# EAGLE design tfsasi (EAGLE 9.6.2)
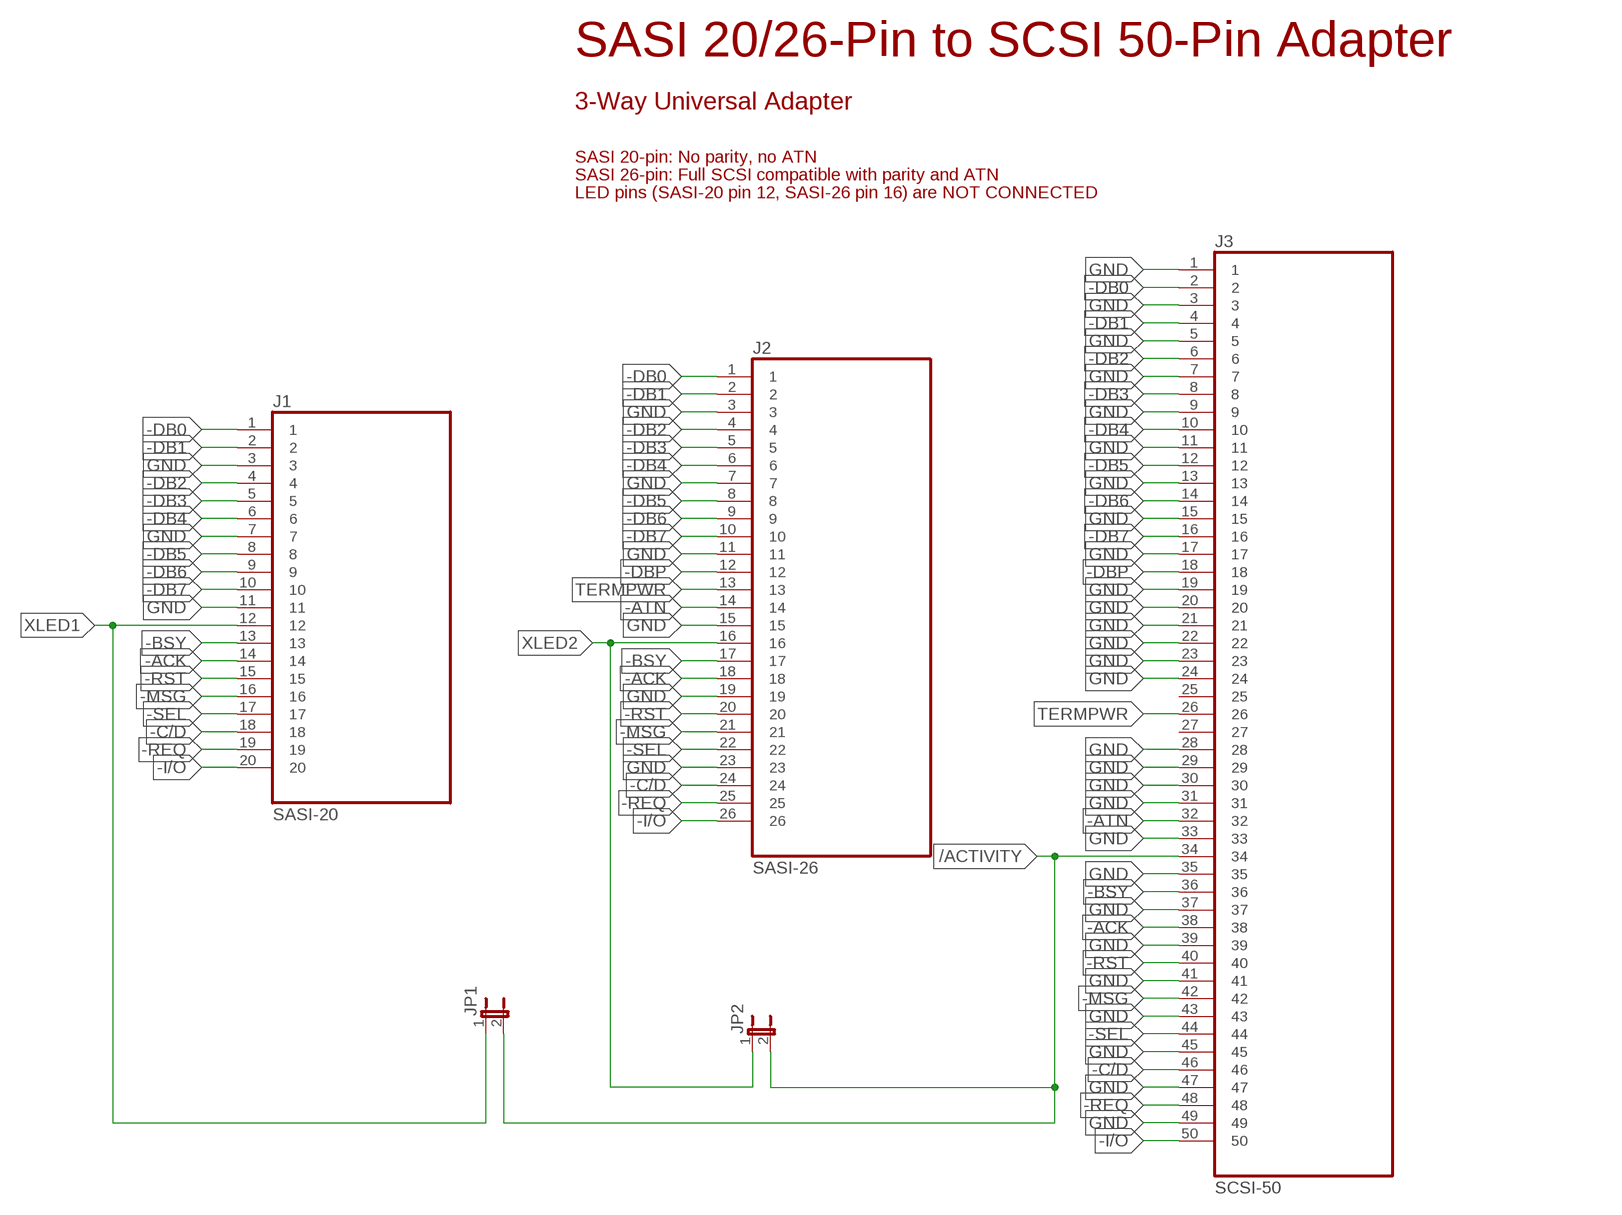
[diagram p0: schematic, sheet 1]

## Parts
J1  SASI-20  [2X10]
J2  SASI-26  [2X13]
J3  SCSI-50  [2X25]
JP1  JUMPER-2PTH  [1X02]
JP2  JUMPER-2PTH  [1X02]

## Nets
-ACK: J1.14 J2.18 J3.38
-ATN: J2.14 J3.32
-BSY: J1.13 J2.17 J3.36
-C/D: J1.18 J2.24 J3.46
-DB0: J1.1 J2.1 J3.2
-DB1: J1.2 J2.2 J3.4
-DB2: J1.4 J2.4 J3.6
-DB3: J1.5 J2.5 J3.8
-DB4: J1.6 J2.6 J3.10
-DB5: J1.8 J2.8 J3.12
-DB6: J1.9 J2.9 J3.14
-DB7: J1.10 J2.10 J3.16
-DBP: J2.12 J3.18
-I/O: J1.20 J2.26 J3.50
-MSG: J1.16 J2.21 J3.42
-REQ: J1.19 J2.25 J3.48
-RST: J1.15 J2.20 J3.40
-SEL: J1.17 J2.22 J3.44
/ACTIVITY: J3.34 JP1.2 JP2.2
GND: J1.3 J1.7 J1.11 J2.3 J2.7 J2.11 J2.15 J2.19 J2.23 J3.1 J3.3 J3.5 J3.7 J3.9 J3.11 J3.13 J3.15 J3.17 J3.19 J3.20 J3.21 J3.22 J3.23 J3.24 J3.28 J3.29 J3.30 J3.31 J3.33 J3.35 J3.37 J3.39 J3.41 J3.43 J3.45 J3.47 J3.49
TERMPWR: J2.13 J3.26
XLED1: J1.12 JP1.1
XLED2: J2.16 JP2.1
Unconnected: J3.25 J3.27

## Notes on the sheet
- SASI 20/26-Pin to SCSI 50-Pin Adapter
- 3-Way Universal Adapter
- SASI 20-pin: No parity, no ATN
- SASI 26-pin: Full SCSI compatible with parity and ATN
- LED pins (SASI-20 pin 12, SASI-26 pin 16) are NOT CONNECTED

## Library data of the parts
J1 = connector:SASI-20: SASI 20-Pin Connector
J2 = connector:SASI-26: SASI 26-Pin Connector
J3 = connector:SCSI-50: SCSI 50-Pin Connector
JP1 JP2 = SparkFun-Retired:JUMPER-2: Jumper Basic 0.1" spaced jumper. Use with breakaway headers.

## Board
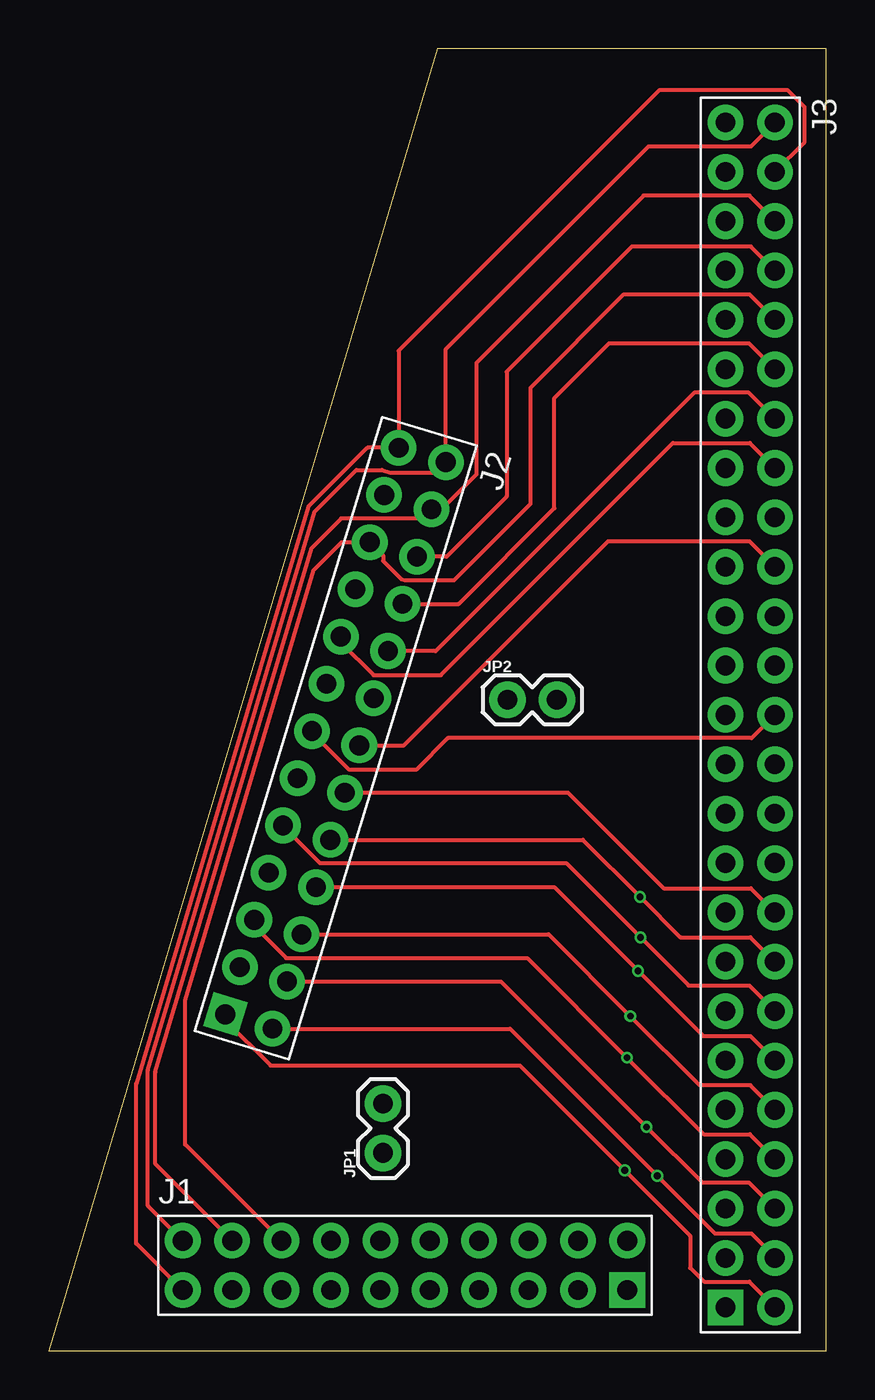
[diagram p1: board, top side]
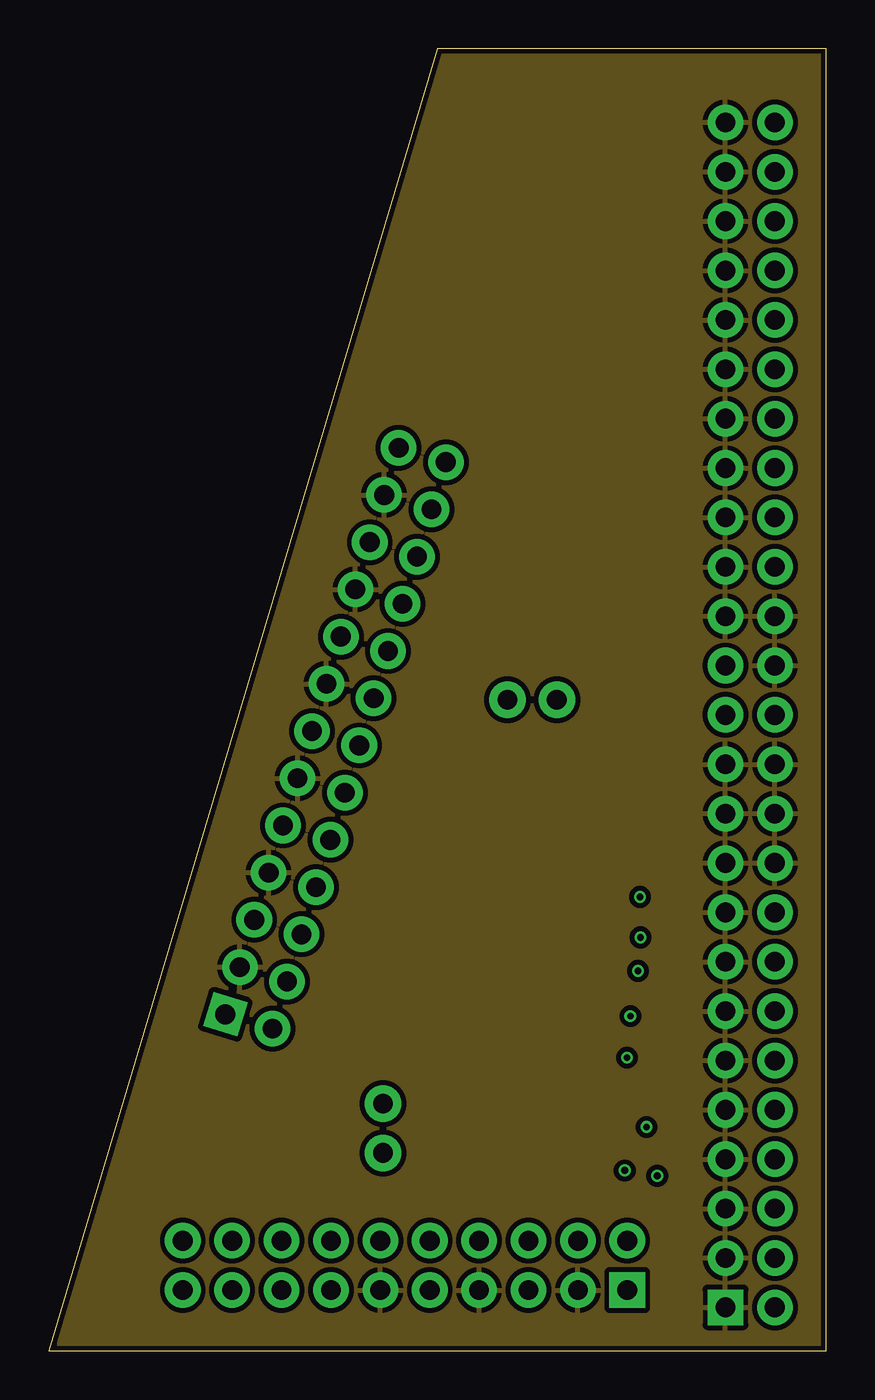
[diagram p2: board, inner layer Route2]
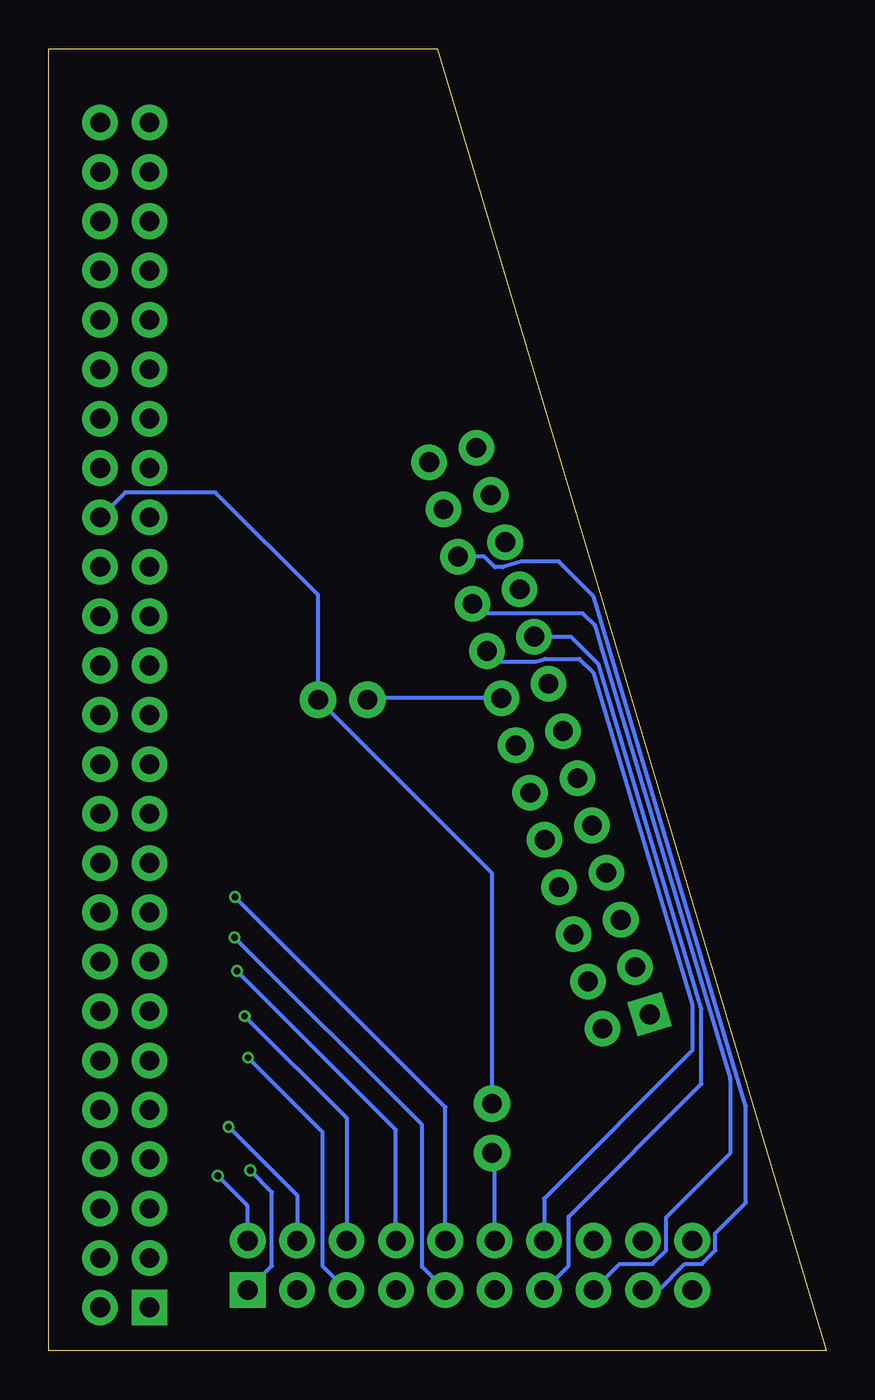
[diagram p3: board, bottom side, seen from below]

Size 40 x 67 mm. Coordinates in mm from the lower left corner, seen from the top.
Outline: 0,0 40,0 40,67 20,67 0,0
Copper layers (1+2*15+16): Top 0.035mm / dielectric 0.2mm / Route2 0.0175mm / dielectric 1.065mm / Route15 0.0175mm / dielectric 0.2mm / Bottom 0.035mm
Design rules "jlcpcb-4layers *": minimum track width 3.5mil, minimum drill 0.2mm, track to track 7mil, track to pad 7mil, pad to pad 7mil, via to via 7mil, smd to smd 7mil, copper to edge 0.2mm, drill to drill 6mil, minimum pad ring 10mil, minimum via ring 0.13mm, stop-mask expansion 0.05mm, vias tented up to drill 16mil, thermal gap 10mil

### Footprints (pad centres in the part's own frame; a part is rotated, then mirrored left to right if it is on the bottom)
2X10 = drill 1.016 square: 1 11.43,-1.27 | drill 1.016: 2 11.43,1.27; 3 8.89,-1.27; 4 8.89,1.27; 5 6.35,-1.27; 6 6.35,1.27; 7 3.81,-1.27; 8 3.81,1.27; 9 1.27,-1.27; 10 1.27,1.27; 11 -1.27,-1.27; 12 -1.27,1.27; 13 -3.81,-1.27; 14 -3.81,1.27; 15 -6.35,-1.27; 16 -6.35,1.27; 17 -8.89,-1.27; 18 -8.89,1.27; 19 -11.43,-1.27; 20 -11.43,1.27
2X13 = drill 1.016 square: 1 15.24,-1.27 | drill 1.016: 2 15.24,1.27; 3 12.7,-1.27; 4 12.7,1.27; 5 10.16,-1.27; 6 10.16,1.27; 7 7.62,-1.27; 8 7.62,1.27; 9 5.08,-1.27; 10 5.08,1.27; 11 2.54,-1.27; 12 2.54,1.27; 13 0,-1.27; 14 0,1.27; 15 -2.54,-1.27; 16 -2.54,1.27; 17 -5.08,-1.27; 18 -5.08,1.27; 19 -7.62,-1.27; 20 -7.62,1.27; 21 -10.16,-1.27; 22 -10.16,1.27; 23 -12.7,-1.27; 24 -12.7,1.27; 25 -15.24,-1.27; 26 -15.24,1.27
2X25 = drill 1.016 square: 1 30.48,-1.27 | drill 1.016: 2 30.48,1.27; 3 27.94,-1.27; 4 27.94,1.27; 5 25.4,-1.27; 6 25.4,1.27; 7 22.86,-1.27; 8 22.86,1.27; 9 20.32,-1.27; 10 20.32,1.27; 11 17.78,-1.27; 12 17.78,1.27; 13 15.24,-1.27; 14 15.24,1.27; 15 12.7,-1.27; 16 12.7,1.27; 17 10.16,-1.27; 18 10.16,1.27; 19 7.62,-1.27; 20 7.62,1.27; 21 5.08,-1.27; 22 5.08,1.27; 23 2.54,-1.27; 24 2.54,1.27; 25 0,-1.27; 26 0,1.27; 27 -2.54,-1.27; 28 -2.54,1.27; 29 -5.08,-1.27; 30 -5.08,1.27; 31 -7.62,-1.27; 32 -7.62,1.27; 33 -10.16,-1.27; 34 -10.16,1.27; 35 -12.7,-1.27; 36 -12.7,1.27; 37 -15.24,-1.27; 38 -15.24,1.27; 39 -17.78,-1.27; 40 -17.78,1.27; 41 -20.32,-1.27; 42 -20.32,1.27; 43 -22.86,-1.27; 44 -22.86,1.27; 45 -25.4,-1.27; 46 -25.4,1.27; 47 -27.94,-1.27; 48 -27.94,1.27; 49 -30.48,-1.27; 50 -30.48,1.27
1X02 = drill 1.016 pad 1.88: 1 0,0; 2 2.54,0

### Placement (x,y rotation side)
J1  18.33,4.4 0 top
J2  14.76,31.52 253 top
J3  36.08,32.72 270 top
JP1  17.2,10.19 90 top
JP2  23.6,33.5 0 top

### Tracks (layer width: path | path; a pad name or v marks a point on that pad's centre or on a via)
-ACK
  Top 0.203: J3.38 36.01,49.3 33.2,49.3 19.9,36.01 J2.18
  Bottom 0.203: J2.18 16.91,35.46 14.95,35.46 14.46,35.61 12.71,35.61 11.99,34.89 6.89,17.8 6.89,15.46 14.52,7.83 J1.14
-ATN
  Top 0.203: J2.14 18.27,31.15 28.78,41.66 36.03,41.66 J3.32
-BSY
  Top 0.203: J2.17 15.03,36.45 16.71,34.77 20.17,34.77 32.11,46.71 36.06,46.71 J3.36
  Bottom 0.203: J2.17 13.15,36.75 11.72,35.31 6.43,17.61 6.43,13.73 13.26,6.91 13.26,4.39 J1.13
-C/D
  Top 0.203: J3.46 36.03,59.44 30.61,59.44 22,50.83 22,45.09 20.2,43.29 J2.24 19.22,42.82 15.05,42.82 13.54,41.31 5.49,14.34 5.49,9.62 J1.18
-DB0  (via drill 0.35)
  Top 0.203: J2.1 9.09,17.01 11.42,14.68 24.23,14.68 v29.63,9.28 32.99,5.92 32.99,4.27 33.71,3.56 36.03,3.56 J3.2
  Bottom 0.203: v29.63,9.28 28.52,8.17 28.52,4.38 J1.1
-DB1  (via drill 0.35)
  Top 0.203: J2.2 23.73,16.57 v31.3,9 34.27,6.04 36.14,6.04 37.35,4.84 J3.4
  Bottom 0.203: J1.2 29.76,7.46 v31.3,9
-DB2  (via drill 0.35)
  Top 0.203: J2.4 23.26,19 v30.75,11.52 33.6,8.66 36.01,8.66 J3.6
  Bottom 0.203: v30.75,11.52 27.22,7.99 J1.4
-DB3  (via drill 0.35)
  Top 0.203: J2.5 10.57,21.86 12.22,20.22 24.61,20.22 v29.74,15.09 33.68,11.15 36.06,11.15 J3.8
  Bottom 0.203: J1.5 25.91,4.36 25.91,11.25 v29.74,15.09
-DB4  (via drill 0.35)
  Top 0.203: J3.10 36.09,13.66 33.48,13.66 v29.92,17.22 25.71,21.43 J2.6
  Bottom 0.203: v29.92,17.22 24.68,11.98 J1.6
-DB5  (via drill 0.35)
  Top 0.203: J2.8 26,23.86 v30.32,19.55 33.66,16.2 36.09,16.2 J3.12
  Bottom 0.203: J1.8 22.14,11.37 v30.32,19.55
-DB6  (via drill 0.35)
  Top 0.203: J2.9 12.06,26.98 13.95,25.09 26.62,25.09 v30.44,21.27 32.92,18.8 36.03,18.8 J3.14
  Bottom 0.203: J1.9 20.79,4.32 20.79,11.62 v30.44,21.27
-DB7  (via drill 0.35)
  Top 0.203: J2.10 27.48,26.29 v30.42,23.36 32.49,21.29 36.09,21.29 J3.16
  Bottom 0.203: J1.10 19.6,12.54 v30.42,23.36
-DBP
  Top 0.203: J2.12 26.7,28.72 31.62,23.8 36.11,23.8 J3.18
-I/O
  Top 0.203: J3.50 36.13,61.98 30.86,61.98 20.43,51.55 J2.26 19.89,45.18 17.59,45.18 17.14,45.32 15.83,45.32 13.69,43.17 5.11,14.43 5.11,7.46 J1.20
-MSG
  Top 0.203: J3.42 36.03,54.36 29.59,54.36 24.79,49.55 24.79,43.59 20.85,39.65 18.32,39.65 18.15,39.7 17.21,40.64 17.21,40.91 J2.21 15.07,41.61 13.63,40.16 7.02,18.04 7.02,10.63 J1.16
-REQ
  Top 0.203: J3.48 38.88,62.19 38.88,63.99 38.02,64.85 31.39,64.85 18,51.45 J2.25 16.39,46.47 13.36,43.43 4.5,13.75 4.5,5.53 J1.19
-RST
  Top 0.203: J2.20 21.09,38.44 26.01,43.36 26.01,49.02 28.83,51.84 36.01,51.84 J3.40
  Bottom 0.203: J1.15 10.63,4.48 8.95,4.48 8.25,5.18 8.25,6.86 4.95,10.16 4.95,13.99 11.56,36.12 | J2.20 17.72,37.96 12.55,37.96 11.92,37.34 11.56,36.12 | 11.56,36.12
-SEL
  Top 0.203: J3.44 36.11,56.82 30,56.82 23.56,50.38 23.56,43.95 20.47,40.87 J2.22
  Bottom 0.203: J1.17 8.63,3.13 7.28,4.48 6.41,4.48 5.71,5.18 5.71,6.05 4.14,7.62 4.14,12.59 11.97,38.81 13.76,40.61 15.69,40.61 16.64,40.32 17.05,40.32 17.59,40.87 J2.22
/ACTIVITY
  Bottom 0.203: JP1.2 17.2,24.56 JP2.2 26.14,38.89 31.42,44.17 36.06,44.17 J3.34
GND
  pour Route2 (isolate 0.254): 20,67 0,0 40,0 40,67
TERMPWR
  Top 0.203: J2.13 13.54,31.82 15.46,29.9 18.9,29.9 20.53,31.53 36.16,31.53 J3.26
XLED1
  Bottom 0.203: J1.12 17.06,10.05 JP1.1
XLED2
  Bottom 0.203: J2.16 23.52,33.58 JP2.1